# Altium project Mp100.PrjPCB
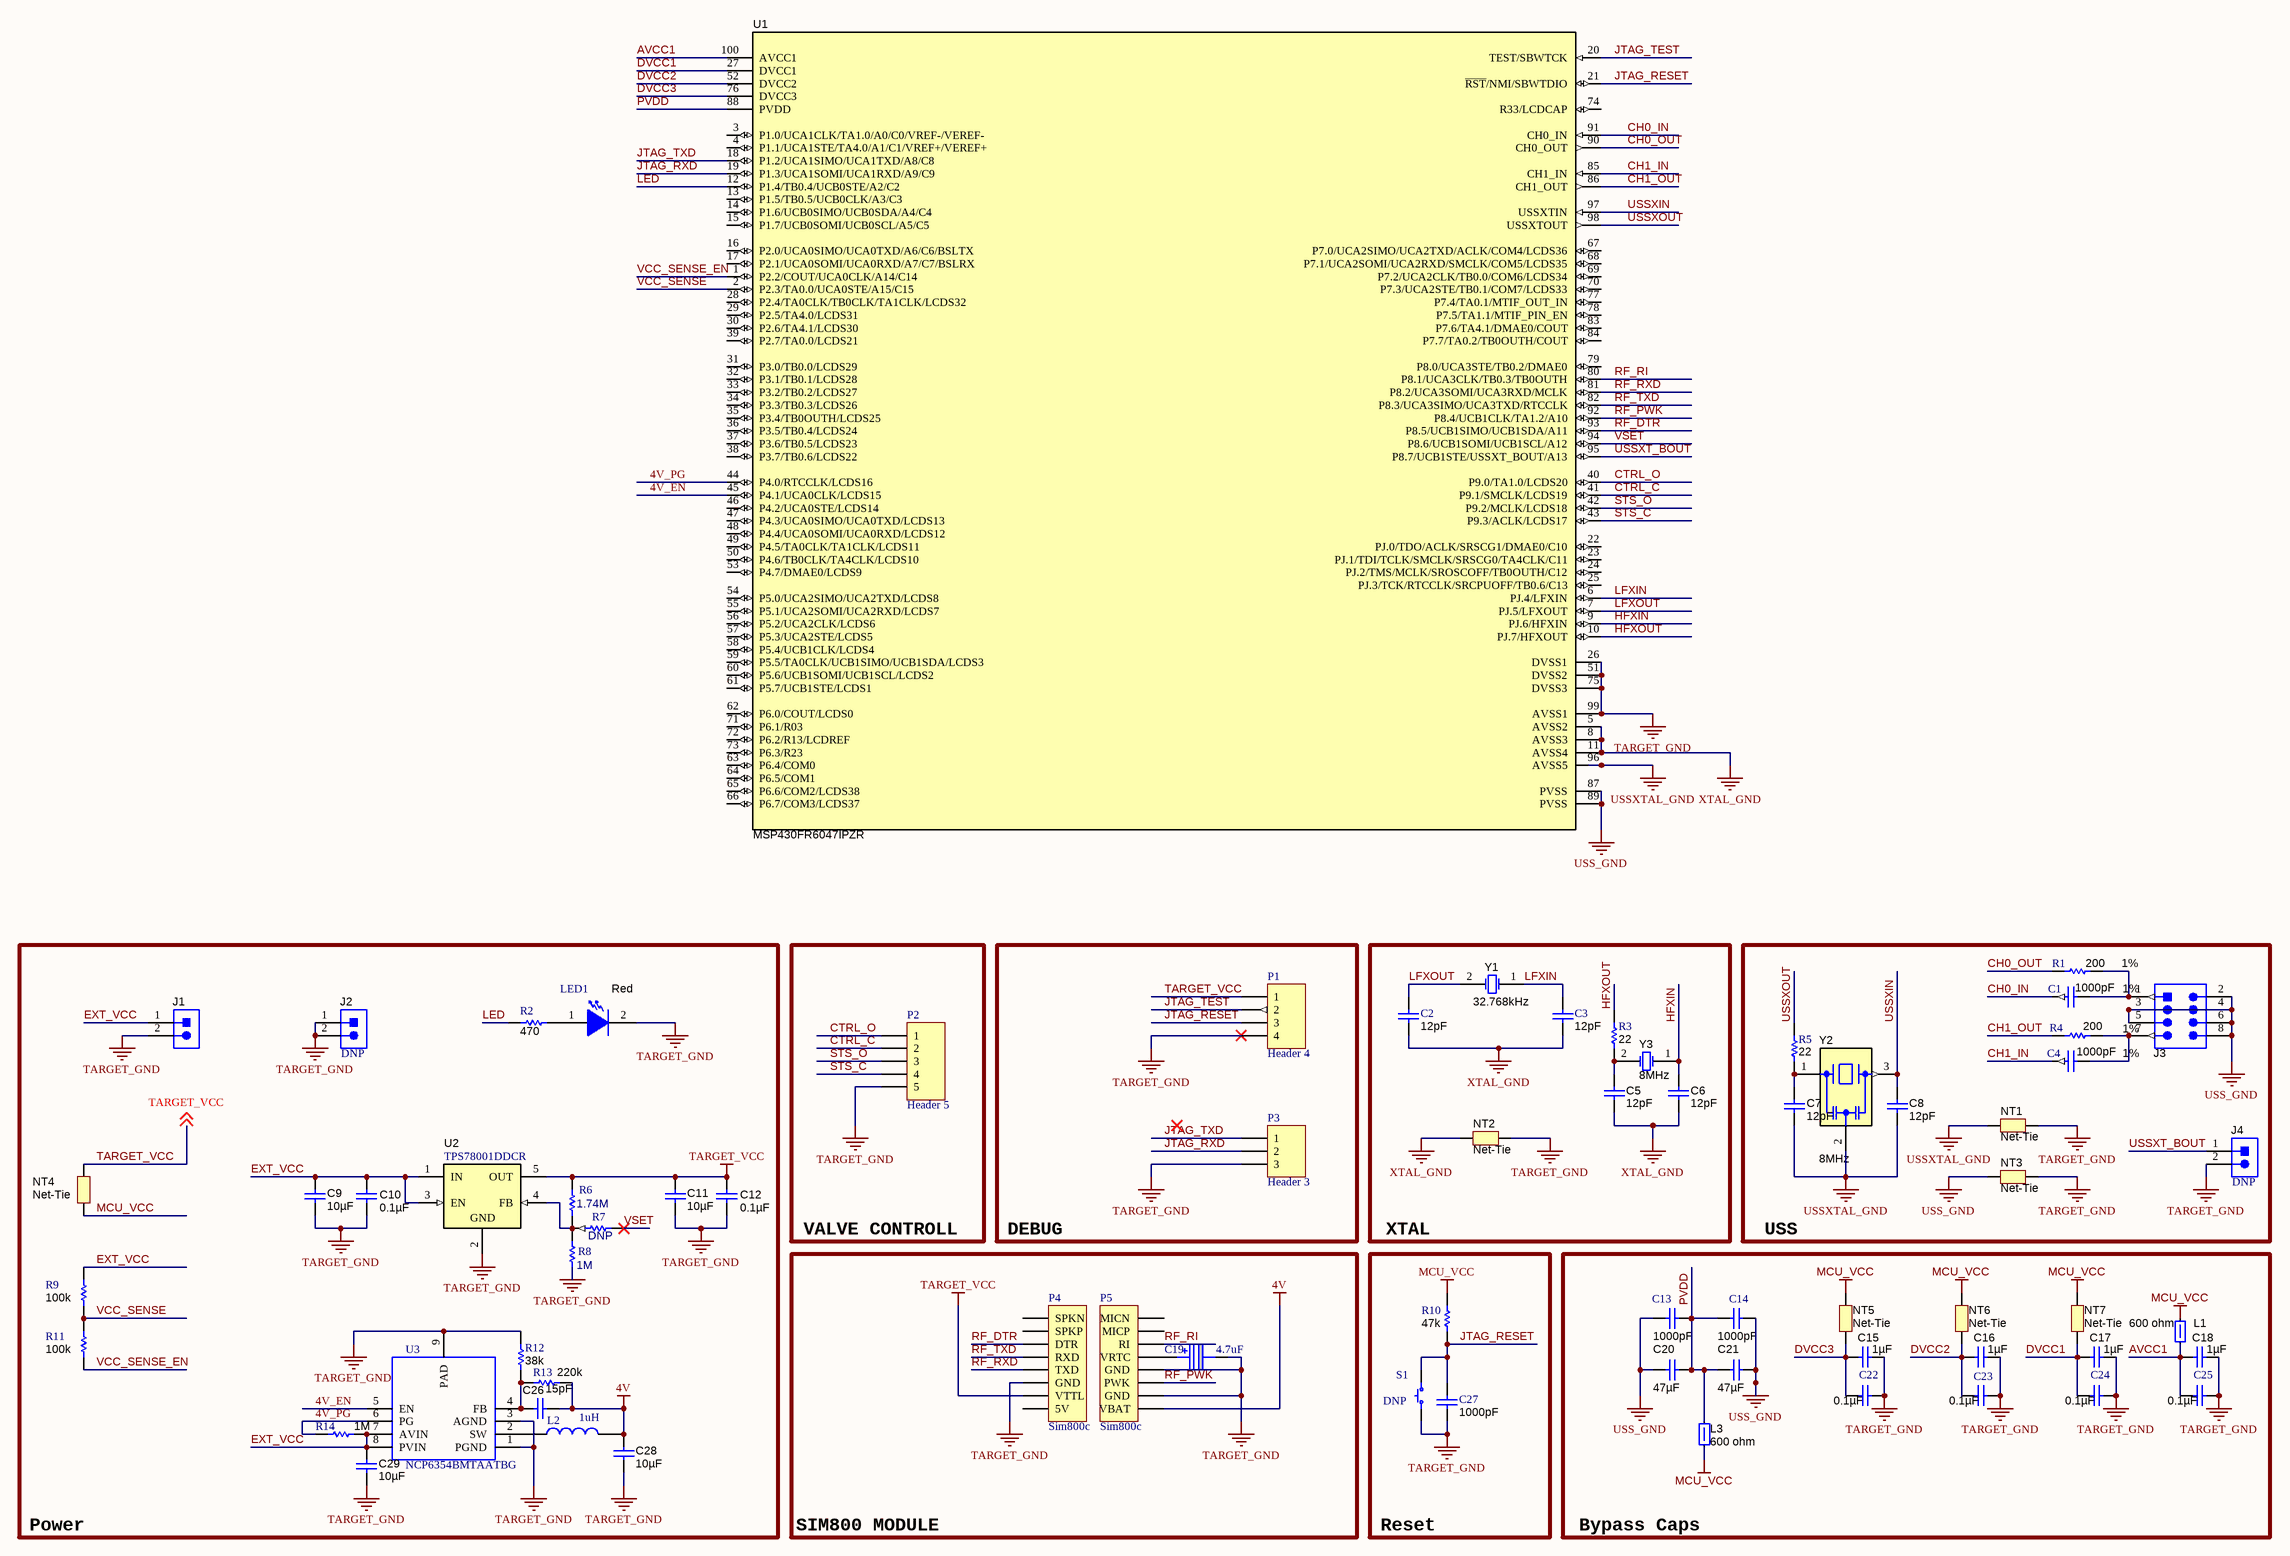
[diagram p0: Mp100.SchDoc]
1 sheet, 70 parts. Net scope: global (net labels, ports and power ports of the same name join across sheets).
Board file: Mp100.PcbDoc

## Sheet Mp100.SchDoc: MP100
size C; CompanyName: AquaSAFE; Organization: AquaSAFE; Address1: Kaf-tet BeNovember 12a; Address2: Zechron yakkov; Address3: 3090000; Address4: Israel; DocumentNumber: 1; Revision: 0.3

### Parts
C1  ValueDisplayed: 1000pF  Tolerance_%: 1%  [CAPC1608X90N]  (hidden comment: GRM1885C1H102FA01J)
C2  ValueDisplayed: 12pF  [CAPC1005X55N]  (hidden comment: GRM1555C1H120JA01D)
C3  ValueDisplayed: 12pF  [CAPC1005X55N]  (hidden comment: GRM1555C1H120JA01D)
C4  ValueDisplayed: 1000pF  Tolerance_%: 1%  [CAPC1608X90N]  (hidden comment: GRM1885C1H102FA01J)
C5  ValueDisplayed: 12pF  [CAPC1005X55N]  (hidden comment: GRM1555C1H120JA01D)
C6  ValueDisplayed: 12pF  [CAPC1005X55N]  (hidden comment: GRM1555C1H120JA01D)
C7  ValueDisplayed: 12pF  [CAPC1005X55N]  (hidden comment: GRM1555C1H120JA01D)
C8  ValueDisplayed: 12pF  [CAPC1005X55N]  (hidden comment: GRM1555C1H120JA01D)
C9  ValueDisplayed: 10µF  [CAPC1608X90N]  (hidden comment: GRM188R61A106ME69D)
C10  ValueDisplayed: 0.1µF  [CAPC1005X55N]  (hidden comment: GRM155R71C104KA88D)
C11  ValueDisplayed: 10µF  [CAPC1608X90N]  (hidden comment: GRM188R61A106ME69D)
C12  ValueDisplayed: 0.1µF  [CAPC1005X55N]  (hidden comment: GRM155R71C104KA88D)
C13  ValueDisplayed: 1000pF  [CAPC1005X55N]  (hidden comment: GRM1555C1H102JA01D)
C14  ValueDisplayed: 1000pF  [CAPC1005X55N]  (hidden comment: GRM1555C1H102JA01D)
C15  ValueDisplayed: 1µF  [CAPC1608X90N]  (hidden comment: GRM188R71A105KA61D)
C16  ValueDisplayed: 1µF  [CAPC1608X90N]  (hidden comment: GRM188R71A105KA61D)
C17  ValueDisplayed: 1µF  [CAPC1608X90N]  (hidden comment: GRM188R71A105KA61D)
C18  ValueDisplayed: 1µF  [CAPC1608X90N]  (hidden comment: GRM188R71A105KA61D)
C19  DisplayValue: 4.7uF  [CAPAE430X550N]  (hidden comment: 865090340001)
C20  ValueDisplayed: 47µF  [CAPC2012X145N]  (hidden comment: GRM21BR60J476ME15L)
C21  ValueDisplayed: 47µF  [CAPC2012X145N]  (hidden comment: GRM21BR60J476ME15L)
C22  ValueDisplayed: 0.1µF  [CAPC1005X55N]  (hidden comment: GRM155R71C104KA88D)
C23  ValueDisplayed: 0.1µF  [CAPC1005X55N]  (hidden comment: GRM155R71C104KA88D)
C24  ValueDisplayed: 0.1µF  [CAPC1005X55N]  (hidden comment: GRM155R71C104KA88D)
C25  ValueDisplayed: 0.1µF  [CAPC1005X55N]  (hidden comment: GRM155R71C104KA88D)
C26  ValueDisplayed: 15pF  [CAPC1005X55N]  (hidden comment: GRM1555C1H120JA01D)
C27  ValueDisplayed: 1000pF  [CAPC1005X55N]  (hidden comment: GRM1555C1H102JA01D)
C28  ValueDisplayed: 10µF  [CAPC1608X90N]  (hidden comment: GRM188R61A106ME69D)
C29  ValueDisplayed: 10µF  [CAPC1608X90N]  (hidden comment: GRM188R61A106ME69D)
J1  TSW-102-07-G-S  [HDR1X2]  (value not drawn)  (no BOM)
J2  TSW-102-07-G-S  [HDR1X2]  (value not drawn)  (no BOM)
J3  TSW-104-07-G-D  [HDR2X4]  (value not drawn)  (no BOM)
J4  HMTSW-102-07-G-S-240  [HDR1X2]  (value not drawn)  (no BOM)
L1  value 600 ohm  [6-0805_L]  (hidden comment: MPZ2012S601A)
L2  value 1uH  [INDM4040X180N]  (hidden comment: LQH44PN1R0NP0L)
L3  value 600 ohm  [6-0805_L]  (hidden comment: MPZ2012S601A)
LED1  value Red  [LEDC1608X90N]  (hidden comment: LTST-C190CKT)
NT1  Net-Tie  [2way_MP]  (net tie, no BOM)
NT2  Net-Tie  [2way_MP]  (net tie, no BOM)
NT3  Net-Tie  [2way_MP]  (net tie, no BOM)
NT4  Net-Tie  [2way_MP]  (net tie, no BOM)
NT5  Net-Tie  [2way_MP]  (net tie, no BOM)
NT6  Net-Tie  [2way_MP]  (net tie, no BOM)
NT7  Net-Tie  [2way_MP]  (net tie, no BOM)
P1  Header 4  [HDR1X4]  (no BOM)
P2  Header 5  [HDR1X5]  (no BOM)
P3  Header 3  [HDR1X3]  (no BOM)
P4  Sim800c  [HDR1X8]  (no BOM)
P5  Sim800c  [HDR1X8]  (no BOM)
R1  ValueDisplayed: 200  Value1: 1%  [RESC1005X40N]  (hidden comment: CRCW0402200RFKED)
R2  ValueDisplayed: 470  [RESC1005X40N]  (hidden comment: CRCW0402470RJNED)
R3  ValueDisplayed: 22  [RESC1005X40N]  (hidden comment: CRCW040222R0JNED)
R4  ValueDisplayed: 200  Value1: 1%  [RESC1005X40N]  (hidden comment: CRCW0402200RFKED)
R5  ValueDisplayed: 22  [RESC1005X40N]  (hidden comment: CRCW040222R0JNED)
R6  value 1.74M  [RESC1005X40N]  (hidden comment: CRCW04021M74FKED)
R7  DNP  [RESC1005X40N]  (no BOM)
R8  value 1M  [RESC1005X40N]  (hidden comment: CRCW04021M00JNED)
R9  ValueDisplayed: 100k  [RESC1005X40N]  (hidden comment: CRCW0402100KJNED)
R10  ValueDisplayed: 47k  [RESC1005X40N]  (hidden comment: CRCW040247K0JNED)
R11  ValueDisplayed: 100k  [RESC1005X40N]  (hidden comment: CRCW0402100KJNED)
R12  ValueDisplayed: 38k  [RESC1005X40N]  (hidden comment: CRCW0402470RJNED)
R13  ValueDisplayed: 220k  [RESC1005X40N]  (hidden comment: CRCW0402470RJNED)
R14  ValueDisplayed: 1M  [RESC1005X40N]  (hidden comment: CRCW0402100KJNED)
S1  placment: DNP  [HDR1X2]  (hidden comment: SPST-NO)  (no BOM)
U1  MSP430FR6047IPZR  [QFP50P1600X1600X160-100N]
U2  TPS78001DDCR  [SOT95P280X145-5N]
U3  NCP6354BMTAATBG  [SON50P200X200X80-9N-D]
Y1  Frequency: 32.768kHz  [ABS-07]  (hidden comment: ABS07-32.768KHZ-9-T)
Y2  Frequency: 8MHz  [Abracon_AWSCR-8.00CV-T_0]  (hidden comment: AWSCR-8.00CV-T)
Y3  Frequency: 8MHz  [ABM38000MHzD2YT]  (hidden comment: ABM3-8.000MHZ-D2Y-T)

### Blocks framed on the sheet
Power: C9-C12 C26 C28 C29 J1 J2 L2 LED1 NT4 R2 R6-R9 R11-R14 U2 U3
VALVE CONTROLL: P2
DEBUG: P1 P3
XTAL: C2 C3 C5 C6 NT2 R3 Y1 Y3
USS: C1 C4 C7 C8 J3 J4 NT1 NT3 R1 R4 R5 Y2
SIM800 MODULE: C19 P4 P5
Reset: C27 R10 S1
Bypass Caps: C13-C18 C20-C25 L1 L3 NT5-NT7

### Nets
4V: C26.2 C28.1 L2.2 P5.1(VBAT) R13.2
MCU_VCC: L1.2 L3.2 NT4.1 NT5.2 NT6.2 NT7.2 R10.2
TARGET_GND: C9.2 C10.2 C11.2 C12.2 C15.2 C16.1 C17.2 C18.2 C19.2(-) C22.2 C23.2 C24.1 C25.2 C27.2 C28.2 C29.2 J1.2 J2.1 J2.2 J4.2 LED1.2(K) NT1.2 NT2.2 NT3.2 P1.4 P2.5 P3.3 P4.6(GND) P5.2(GND) P5.4(GND) R8.1 R12.1 S1.1 U1.26(DVSS1) U1.51(DVSS2) U1.75(DVSS3) U1.99(AVSS1) U2.2(GND) U3.1(PGND) U3.3(AGND) U3.9(PAD)
TARGET_VCC: C11.1 C12.1 NT4.2 P1.1 P4.7(VTTL) R6.2 U2.5(OUT) ; off-sheet TARGET_VCC
USS_GND: C13.2 C14.1 C20.1 C21.2 J3.2 J3.3 J3.4 J3.5 J3.6 J3.8 NT3.1 U1.87(PVSS) U1.89(PVSS)
USSXTAL_GND: C7.2 C8.2 NT1.1 U1.96(AVSS5) Y2.2(GND)
XTAL_GND: C2.1 C3.2 C5.2 C6.2 NT2.1 U1.5(AVSS2) U1.8(AVSS3) U1.11(AVSS4)
4V_EN: U1.45(P4.1/UCA0CLK/LCDS15) U3.5(EN)
4V_PG: R14.2 U1.44(P4.0/RTCCLK/LCDS16) U3.6(PG)
AVCC1: C18.1 C25.1 L1.1 U1.100(AVCC1)
CH0_IN: C1.1 U1.91(CH0_IN)
CH0_OUT: R1.2 U1.90(CH0_OUT)
CH1_IN: C4.1 U1.85(CH1_IN)
CH1_OUT: R4.2 U1.86(CH1_OUT)
CTRL_C: P2.2 U1.41(P9.1/SMCLK/LCDS19)
CTRL_O: P2.1 U1.40(P9.0/TA1.0/LCDS20)
DVCC1: C17.1 C24.2 NT7.1 U1.27(DVCC1)
DVCC2: C16.2 C23.1 NT6.1 U1.52(DVCC2)
DVCC3: C15.1 C22.1 NT5.1 U1.76(DVCC3)
EXT_VCC: C9.1 C10.1 C29.1 J1.1 R9.2 R14.1 U2.1(IN) U2.3(EN) U3.7(AVIN) U3.8(PVIN)
HFXIN: C6.1 U1.9(PJ.6/HFXIN) Y3.1(OSC1)
HFXOUT: R3.2 U1.10(PJ.7/HFXOUT)
JTAG_RESET: C27.1 P1.3 R10.1 S1.3 U1.21(~{RST}/NMI/SBWTDIO)
JTAG_RXD: P3.2 U1.19(P1.3/UCA1SOMI/UCA1RXD/A9/C9)
JTAG_TEST: P1.2 U1.20(TEST/SBWTCK)
JTAG_TXD: P3.1 U1.18(P1.2/UCA1SIMO/UCA1TXD/A8/C8)
LED: R2.1 U1.12(P1.4/TB0.4/UCB0STE/A2/C2)
LFXIN: C3.1 U1.6(PJ.4/LFXIN) Y1.1(OSC1)
LFXOUT: C2.2 U1.7(PJ.5/LFXOUT) Y1.2(OSC2)
PVDD: C13.1 C14.2 C20.2 C21.1 L3.1 U1.88(PVDD)
RF_DTR: P4.3(DTR) U1.93(P8.5/UCB1SIMO/UCB1SDA/A11)
RF_PWK: P5.3(PWK) U1.92(P8.4/UCB1CLK/TA1.2/A10)
RF_RI: P5.6(RI) U1.80(P8.1/UCA3CLK/TB0.3/TB0OUTH)
RF_RXD: P4.5(TXD) U1.81(P8.2/UCA3SOMI/UCA3RXD/MCLK)
RF_TXD: P4.4(RXD) U1.82(P8.3/UCA3SIMO/UCA3TXD/RTCCLK)
STS_C: P2.4 U1.43(P9.3/ACLK/LCDS17)
STS_O: P2.3 U1.42(P9.2/MCLK/LCDS18)
USSXIN: C8.1 U1.97(USSXTIN) Y2.3(Out)
USSXOUT: R5.2 U1.98(USSXTOUT)
USSXT_BOUT: J4.1 U1.95(P8.7/UCB1STE/USSXT_BOUT/A13)
VCC_SENSE: R9.1 R11.2 U1.2(P2.3/TA0.0/UCA0STE/A15/C15)
VCC_SENSE_EN: R11.1 U1.1(P2.2/COUT/UCA0CLK/A14/C14)
VSET: R7.1 U1.94(P8.6/UCB1SOMI/UCB1SCL/A12)
NetC1_2: C1.2 J3.1 R1.1
NetC4_2: C4.2 J3.7 R4.1
NetC5_1: C5.1 R3.1 Y3.2(OSC2)
NetC7_1: C7.1 R5.1 Y2.1(In)
NetC19_1: C19.1(+) P5.5(VRTC)
NetC26_1: C26.1 R12.2 R13.1 U3.4(FB)
NetL2_1: L2.1 U3.2(SW)
NetLED1_1: LED1.1(A) R2.2
NetR6_1: R6.1 R7.2 R8.2 U2.4(FB)

Not connected (* = marked no-connect by the designer): P4 1(SPKN) 2(SPKP) 8(5V); P5 7(MICP) 8(MICN); U1 3(P1.0/UCA1CLK/TA1.0/A0/C0/VREF-/VEREF-) 4(P1.1/UCA1STE/TA4.0/A1/C1/VREF+/VEREF+) 13(P1.5/TB0.5/UCB0CLK/A3/C3) 14(P1.6/UCB0SIMO/UCB0SDA/A4/C4) 15(P1.7/UCB0SOMI/UCB0SCL/A5/C5) 16(P2.0/UCA0SIMO/UCA0TXD/A6/C6/BSLTX) 17(P2.1/UCA0SOMI/UCA0RXD/A7/C7/BSLRX) 22(PJ.0/TDO/ACLK/SRSCG1/DMAE0/C10) 23(PJ.1/TDI/TCLK/SMCLK/SRSCG0/TA4CLK/C11) 24(PJ.2/TMS/MCLK/SROSCOFF/TB0OUTH/C12) 25(PJ.3/TCK/RTCCLK/SRCPUOFF/TB0.6/C13) 28(P2.4/TA0CLK/TB0CLK/TA1CLK/LCDS32) 29(P2.5/TA4.0/LCDS31) 30(P2.6/TA4.1/LCDS30) 31(P3.0/TB0.0/LCDS29) 32(P3.1/TB0.1/LCDS28) 33(P3.2/TB0.2/LCDS27) 34(P3.3/TB0.3/LCDS26) 35(P3.4/TB0OUTH/LCDS25) 36(P3.5/TB0.4/LCDS24) 37(P3.6/TB0.5/LCDS23) 38(P3.7/TB0.6/LCDS22) 39(P2.7/TA0.0/LCDS21) 46(P4.2/UCA0STE/LCDS14) 47(P4.3/UCA0SIMO/UCA0TXD/LCDS13) 48(P4.4/UCA0SOMI/UCA0RXD/LCDS12) 49(P4.5/TA0CLK/TA1CLK/LCDS11) 50(P4.6/TB0CLK/TA4CLK/LCDS10) 53(P4.7/DMAE0/LCDS9) 54(P5.0/UCA2SIMO/UCA2TXD/LCDS8) 55(P5.1/UCA2SOMI/UCA2RXD/LCDS7) 56(P5.2/UCA2CLK/LCDS6) 57(P5.3/UCA2STE/LCDS5) 58(P5.4/UCB1CLK/LCDS4) 59(P5.5/TA0CLK/UCB1SIMO/UCB1SDA/LCDS3) 60(P5.6/UCB1SOMI/UCB1SCL/LCDS2) 61(P5.7/UCB1STE/LCDS1) 62(P6.0/COUT/LCDS0) 63(P6.4/COM0) 64(P6.5/COM1) 65(P6.6/COM2/LCDS38) 66(P6.7/COM3/LCDS37) 67(P7.0/UCA2SIMO/UCA2TXD/ACLK/COM4/LCDS36) 68(P7.1/UCA2SOMI/UCA2RXD/SMCLK/COM5/LCDS35) 69(P7.2/UCA2CLK/TB0.0/COM6/LCDS34) 70(P7.3/UCA2STE/TB0.1/COM7/LCDS33) 71(P6.1/R03) 72(P6.2/R13/LCDREF) 73(P6.3/R23) 74(R33/LCDCAP) 77(P7.4/TA0.1/MTIF_OUT_IN) 78(P7.5/TA1.1/MTIF_PIN_EN) 79(P8.0/UCA3STE/TB0.2/DMAE0) 83(P7.6/TA4.1/DMAE0/COUT) 84(P7.7/TA0.2/TB0OUTH/COUT)

### Notes on the sheet
- Title
- Size:
- Date:
- File:
- C
- Number:
- Time:
- Revision:
- Sheet
- of

### Library data of the parts
C1 C4 = GRM1885C1H102FA01J: CAP, CERM, 1000 pF, 50 V, +/- 1%, C0G/NP0, 0603; Manufacturer: MuRata; Value: 1000pF; Polarized: N; CompType: Capacitor; U/M: EA; Cap_F: 0.000000001; Value1: Unknown; VDC_V: 50; Value2: 50V; TaMin_C: -55; TaMax_C: 125; Cap_Case: 0603; AEC Category: Q200; Published: 2008-06-19; LatestRevisionDate: 2016-04-09; PackageReference: 0603; Publisher: Texas Instruments; SymbolVersion: 2008-07-09; PartNumber: GRM1885C1H102FA01J; RoHS: Y; MountType: SMT; Technology: Ceramic; TempCo: C0G/NP0; ComponentLink1Description: Datasheet link; ComponentLink1URL: http://search.murata.co.jp/Ceramy/image/img/A01X/G101/ENG/GRM1885C1H102FA01-01.pdf; Supplier 1: Digi-Key; Supplier Part Number 1: 490-6377-1-ND; AEC Qualified: ?
C2 C3 = GRM1555C1H120JA01D: CAP, CERM, 12 pF, 50 V, +/- 5%, C0G/NP0, 0402; Manufacturer: MuRata; Value: 12pF; Polarized: N; CompType: Capacitor; U/M: EA; Cap_F: 0.000000000012; Tolerance_%: 5; Value1: Unknown; VDC_V: 50; Value2: 50V; TaMin_C: -55; TaMax_C: 125; Cap_Case: 0402; AEC Category: Q200; Published: 2008-06-19; LatestRevisionDate: 2016-04-09; PackageReference: 0402; Publisher: Texas Instruments; SymbolVersion: 2008-07-09; PartNumber: GRM1555C1H120JA01D; RoHS: Y; MountType: SMT; Technology: Ceramic; TempCo: C0G/NP0; ComponentLink1Description: Datasheet link; ComponentLink1URL: http://search.murata.co.jp/Ceramy/PnsearchViewAction.do?HnOFG=ON&HnNFG=ON&SEL_CNT=50&sLang=en&sKey=GRM1555C1H120JA01D&x=9&y=9&search=startwith; Supplier 1: Mouser; Supplier Part Number 1: 81-GRM1555C1H120JA1D; Supplier 2: Farnell; Supplier Part Number 2: 1828875; Supplier 3: Newark; Supplier Part Number 3: 14T3292; AEC Qualified: ?
C5-C8 C26 = GRM1555C1H120JA01D: CAP, CERM, 12 pF, 50 V, +/- 5%, C0G/NP0, 0402; Manufacturer: MuRata; Polarized: N; CompType: Capacitor; Value: 12pF; U/M: EA; Cap_F: 0.000000000012; Tolerance_%: 5; Value1: Unknown; VDC_V: 50; Value2: 50V; TaMin_C: -55; TaMax_C: 125; Cap_Case: 0402; SizeArea_mm2: 0.5; SizeAreaWB_mm2: 3; SizeX_mm: 1; SizeZ_mm: 0.6; AEC Category: Q200; SymbolVersion: 2008-07-09; PartNumber: GRM1555C1H120JA01D; PackageReference: 0402; RoHS: Y; MountType: SMT; Technology: Ceramic; TempCo: C0G/NP0; SizeY_mm: 0.5; Published: 2008-06-19; Publisher: Texas Instruments; ComponentLink1Description: Datasheet link; ComponentLink1URL: http://search.murata.co.jp/Ceramy/PnsearchViewAction.do?HnOFG=ON&HnNFG=ON&SEL_CNT=50&sLang=en&sKey=GRM1555C1H120JA01D&x=9&y=9&search=startwith; Supplier 1: Mouser; Supplier Part Number 1: 81-GRM1555C1H120JA1D; Supplier 2: Farnell; Supplier Part Number 2: 1828875; Supplier 3: Newark; Supplier Part Number 3: 14T3292; AEC Qualified: ?
  C5 C6 C26: LatestRevisionDate: 2016-11-28
  C7 C8: LatestRevisionDate: 2017-01-30
C9 C11 C28 C29 = GRM188R61A106ME69D: CAP, CERM, 10 µF, 10 V, +/- 20%, X5R, 0603; Manufacturer: MuRata; Polarized: N; CompType: Capacitor; Value: 10uF; U/M: EA; Cap_F: 0.00001; Tolerance_%: 20; Value1: Unknown; VDC_V: 10; Value2: 10V; TaMin_C: -55; TaMax_C: 85; Cap_Case: 0603; AEC Category: Q200; SizeArea_mm2: 1.28; SizeAreaWB_mm2: 4.68; SizeX_mm: 1.6; SizeY_mm: 0.8; SizeZ_mm: 1; SymbolVersion: 2008-07-09; PartNumber: GRM188R61A106ME69D; PackageReference: 0603; RoHS: Y; MountType: SMT; Technology: Ceramic; Publisher: Texas Instruments; LatestRevisionDate: 2016-05-21; ComponentLink1Description: Datasheet link; ComponentLink1URL: http://psearch.murata.com/capacitor/product/GRM188R61A106ME69%23.pdf; TempCo: X5R; Published: 2008-06-19; AEC Qualified: ?; Supplier 4: Quest; Supplier Part Number 4: GRM188R61A106ME69D
C10 C12 = GRM155R71C104KA88D: CAP, CERM, 0.1 µF, 16 V, +/- 10%, X7R, 0402; Manufacturer: MuRata; Polarized: N; CompType: Capacitor; Value: 0.1uF; U/M: EA; Cap_F: 0.0000001; Tolerance_%: 10; Value1: Unknown; VDC_V: 16; Value2: 16V; TaMin_C: -55; TaMax_C: 125; Cap_Case: 0402; AEC Category: Q200; SymbolVersion: 2008-07-09; PartNumber: GRM155R71C104KA88D; PackageReference: 0402; RoHS: Y; MountType: SMT; Technology: Ceramic; TempCo: X7R; Published: 2008-06-19; Publisher: Texas Instruments; LatestRevisionDate: 2016-03-01; ComponentLink1Description: Datasheet link; ComponentLink1URL: http://search.murata.co.jp/Ceramy/PnsearchViewAction.do?HnOFG=ON&HnNFG=ON&SEL_CNT=50&sLang=en&sKey=GRM155R71C104KA88D&x=9&y=9&search=startwith; Supplier 1: Digi-Key; Supplier Part Number 1: 490-3261-1-ND; Supplier 2: Mouser; Supplier Part Number 2: 81-GRM155R71C104KA88; Supplier 3: Farnell; Supplier Part Number 3: 8819742; AEC Qualified: ?
C13 C14 C27 = GRM1555C1H102JA01D: CAP, CERM, 1000 pF, 50 V, +/- 5%, C0G/NP0, 0402; Manufacturer: MuRata; Value: 1000pF; Polarized: N; CompType: Capacitor; U/M: EA; Cap_F: 0.000000001; Tolerance_%: 5; Value1: Unknown; VDC_V: 50; Value2: 50V; TaMin_C: -55; TaMax_C: 125; Cap_Case: 0402; AEC Category: Q200; Published: 2008-06-19; LatestRevisionDate: 2016-04-09; PackageReference: 0402; Publisher: Texas Instruments; SymbolVersion: 2008-07-09; PartNumber: GRM1555C1H102JA01D; RoHS: Y; MountType: SMT; Technology: Ceramic; TempCo: C0G/NP0; ComponentLink1Description: Datasheet link; ComponentLink1URL: http://search.murata.co.jp/Ceramy/PnsearchViewAction.do?HnOFG=ON&HnNFG=ON&SEL_CNT=50&sLang=en&sKey=GRM1555C1H102JA01D&x=9&y=9&search=startwith; Supplier 1: Digi-Key; Supplier Part Number 1: 490-3244-1-ND; Supplier 2: Mouser; Supplier Part Number 2: 81-GRM1555C1H102JA1D; Supplier 3: Farnell; Supplier Part Number 3: 8819556; AEC Qualified: ?
  C27: Supplier 4: Freelance Electronics; Supplier Part Number 4: GRM1555C1H102JA01D
C15-C17 = GRM188R71A105KA61D: CAP, CERM, 1 µF, 10 V, +/- 10%, X7R, 0603; Manufacturer: MuRata; Polarized: N; CompType: Capacitor; Value: 1uF; U/M: EA; Cap_F: 0.000001; Tolerance_%: 10; ESR_ohm: 0.011; Value1: 0.011 ohm; Value2: 10V; TaMin_C: -55; TaMax_C: 125; Cap_Case: 0603; SizeArea_mm2: 1.28; SizeAreaWB_mm2: 4.68; SizeX_mm: 1.6; SizeY_mm: 0.8; SizeZ_mm: 1; AEC Category: Q200; SymbolVersion: 2008-07-09; PartNumber: GRM188R71A105KA61D; PackageReference: 0603; RoHS: Y; VDC_V: 10; MountType: SMT; Technology: Ceramic; TempCo: X7R; Published: 2008-06-19; Publisher: Texas Instruments; LatestRevisionDate: 2016-05-21; ComponentLink1Description: Datasheet link; ComponentLink1URL: http://search.murata.co.jp/Ceramy/PnsearchViewAction.do?HnOFG=ON&HnNFG=ON&SEL_CNT=50&sLang=en&sKey=GRM188R71A105KA61D&x=9&y=9&search=startwith; Supplier 1: Digi-Key; Supplier Part Number 1: 490-3899-1-ND; Supplier 2: Mouser; Supplier Part Number 2: 81-GRM188R71A105KA1D; Supplier 3: Farnell; Supplier Part Number 3: 1845766; AEC Qualified: ?
C18 = GRM188R71A105KA61D: CAP, CERM, 1 µF, 10 V, +/- 10%, X7R, 0603; Manufacturer: MuRata; Polarized: N; CompType: Capacitor; Value: 1uF; U/M: EA; Cap_F: 0.000001; Tolerance_%: 10; ESR_ohm: 0.011; Value1: 0.011 ohm; Value2: 10V; TaMin_C: -55; TaMax_C: 125; Cap_Case: 0603; AEC Category: Q200; SizeArea_mm2: 1.28; SizeAreaWB_mm2: 4.68; SizeX_mm: 1.6; SizeY_mm: 0.8; SizeZ_mm: 1; SymbolVersion: 2008-07-09; PartNumber: GRM188R71A105KA61D; PackageReference: 0603; RoHS: Y; VDC_V: 10; MountType: SMT; Technology: Ceramic; TempCo: X7R; Published: 2008-06-19; Publisher: Texas Instruments; LatestRevisionDate: 2016-05-21; ComponentLink1Description: Datasheet link; ComponentLink1URL: http://search.murata.co.jp/Ceramy/PnsearchViewAction.do?HnOFG=ON&HnNFG=ON&SEL_CNT=50&sLang=en&sKey=GRM188R71A105KA61D&x=9&y=9&search=startwith; Supplier 1: Digi-Key; Supplier Part Number 1: 490-3899-1-ND; Supplier 2: Mouser; Supplier Part Number 2: 81-GRM188R71A105KA1D; Supplier 3: Farnell; Supplier Part Number 3: 1845766; AEC Qualified: ?
C19 = 865090340001: Wurth Elektronik 4.7F 16 V dc Aluminium Electrolytic Capacitor, WCAP-ASLU Series 1000h 5.5 (Dia.) x 3.85mm; Geometry.Height: 5.5mm; Manufacturer_Name: Wurth Elektronik; PartNumber: 865090340001; RS Part Number: *; RS Price/Stock: *; Arrow Part Number: 865090340001; Arrow Price/Stock: *; Datasheet Link: http://uk.rs-online.com/web/p/products/8387942
C20 C21 = GRM21BR60J476ME15L: CAP, CERM, 47 µF, 6.3 V, +/- 20%, X5R, 0805; Manufacturer: MuRata; Polarized: N; CompType: Capacitor; Value: 47uF; U/M: EA; Cap_F: 0.000047; Tolerance_%: 20; Value1: Unknown; VDC_V: 6.3; Value2: 6.3V; TaMin_C: -55; TaMax_C: 85; Cap_Case: 0805; AEC Category: Q200; SizeArea_mm2: 2.5; SizeAreaWB_mm2: 6.75; SizeX_mm: 2; SizeY_mm: 1.25; SizeZ_mm: 1.45; SymbolVersion: 2008-07-09; PartNumber: GRM21BR60J476ME15L; PackageReference: 0805; RoHS: Y; MountType: SMT; Technology: Ceramic; TempCo: X5R; Published: 2008-06-19; Publisher: Texas Instruments; LatestRevisionDate: 2016-05-21; ComponentLink1Description: Datasheet link; ComponentLink1URL: http://psearch.en.murata.com/capacitor/product/GRM21BR60J476ME15%23.pdf; Supplier 1: Digi-Key; Supplier Part Number 1: 490-9960-1-ND; Supplier 2: Mouser; Supplier Part Number 2: 81-GRM21BR60J476ME5L; Supplier 3: Farnell; Supplier Part Number 3: 2362109; AEC Qualified: N; AEC Grade: N/A
C22-C25 = GRM155R71C104KA88D: CAP, CERM, 0.1 µF, 16 V, +/- 10%, X7R, 0402; Manufacturer: MuRata; Value: 0.1uF; Polarized: N; CompType: Capacitor; U/M: EA; Cap_F: 0.0000001; Tolerance_%: 10; Value1: Unknown; VDC_V: 16; Value2: 16V; TaMin_C: -55; TaMax_C: 125; Cap_Case: 0402; AEC Category: Q200; Published: 2008-06-19; LatestRevisionDate: 2016-03-01; PackageReference: 0402; Publisher: Texas Instruments; SymbolVersion: 2008-07-09; PartNumber: GRM155R71C104KA88D; RoHS: Y; MountType: SMT; Technology: Ceramic; TempCo: X7R; ComponentLink1Description: Datasheet link; ComponentLink1URL: http://search.murata.co.jp/Ceramy/PnsearchViewAction.do?HnOFG=ON&HnNFG=ON&SEL_CNT=50&sLang=en&sKey=GRM155R71C104KA88D&x=9&y=9&search=startwith; Supplier 1: Digi-Key; Supplier Part Number 1: 490-3261-1-ND; Supplier 2: Mouser; Supplier Part Number 2: 81-GRM155R71C104KA88; Supplier 3: Farnell; Supplier Part Number 3: 8819742; AEC Qualified: ?
J1 J2 = TSW-102-07-G-S: Header, 100mil, 2x1, Gold, TH; Manufacturer: Samtec; SymbolCreator: a0412235; Pitch_mm: 2.54; Gender: Male; Shrouded: N; Row_Count: 1; Current_A: 6.3; Voltage_V: 550; Cert_CSA: Y; SymbolVersion: 2013-10-31; PartNumber: TSW-102-07-G-S; PackageReference: 2x1 Header; ClassName: Header; CompType: Header; RoHS: Y; MountType: TH; ComponentLink1Description: Datasheet URL; ComponentLink1URL: http://samtec.com/ftppub/pdf/TSW_TH.PDF; Orientation: Vertical; PinCount: 2; ContactFinish: Gold; Color: Black; Cert_UL: Y; Cert_CULUS: N; Cert_VDE: N; Publisher: Texas Instruments; LatestRevisionDate: 2016-04-11; Supplier 1: Digi-Key; Supplier Part Number 1: SAM1029-02-ND
  J2: DNP: DNP
J3 = TSW-104-07-G-D: Header, 100mil, 4x2, Gold, TH; Manufacturer: Samtec; SymbolCreator: a0411947; Pitch_mm: 2.54; Gender: Male; Shrouded: N; Row_Count: 2; Current_A: 6.3; Voltage_V: 550; Cert_CSA: Y; SymbolVersion: 2013-12-22; PartNumber: TSW-104-07-G-D; PackageReference: 4x2 Header; ClassName: Header; CompType: Header; RoHS: Y; MountType: TH; ComponentLink1Description: Datasheet URL; ComponentLink1URL: http://samtec.com/ftppub/pdf/TSW_TH.PDF; Orientation: Vertical; PinCount: 8; RowSpacing_mm: 2.54; ContactFinish: Gold; Color: Black; Cert_UL: Y; Cert_CULUS: N; Cert_VDE: N; Publisher: Texas Instruments; LatestRevisionDate: 2016-12-09; Supplier 1: Digi-Key; Supplier Part Number 1: SAM1028-04-ND; Supplier 4: Avnet Europe; Supplier Part Number 4: TSW-104-07-G-D
J4 = HMTSW-102-07-G-S-240: Header, 100mil, 2x1, Gold, TH; Manufacturer: Samtec; SymbolCreator: a0412235; SymbolVersion: 2013-10-31; PartNumber: HMTSW-102-07-G-S-240; PackageReference: Header, 2.54mm, 2x1, TH; ClassName: Header; CompType: Header; RoHS: Y; MountType: TH; ComponentLink1Description: Datasheet URL; ComponentLink1URL: http://www.samtec.com/documents/webfiles/cpdf/HMTSW-XXX-XX-X-X-XXXX-XX-XX-MKT1.pdf; Publisher: Texas Instruments; LatestRevisionDate: 2016-12-09; Supplier 1: Digi-Key; Supplier Part Number 1: HMTSW-102-07-G-S-240-ND; DNP: DNP
L1 L3 = MPZ2012S601A: Ferrite Bead, 600 ohm @ 100 MHz, 2 A, 0805; Manufacturer: TDK; Imax_A: 2; DCR_ohm: 0.1; Value1: 0.1 ohm; Value2: 2A; ZTyp@100MHz_Ohm: 600; CompType: Ferrite Bead; SymbolVersion: 2009-06-02; PartNumber: MPZ2012S601A; MountType: SMT; PackageReference: 0805; Published: 2014-04-30; Publisher: Texas Instruments; LatestRevisionDate: 2016-04-05; ComponentLink1Description: Datasheet link; ComponentLink1URL: http://www.tdk.co.jp/tefe02/e9413_mpz.pdf; RoHS: Y; Supplier 1: Digi-Key; Supplier Part Number 1: 445-2206-1-ND; Supplier 2: Mouser; Supplier Part Number 2: 810-MPZ2012S601A; Supplier 3: Farnell; Supplier Part Number 3: 1669753
L2 = LQH44PN1R0NP0L: Murata LQH44P_P0 Series Shielded Wire-wound SMD Inductor 1 H 30% 2950mA Idc; Manufacturer_Name: Murata Electronics; Geometry.Height: 1.8mm; Mouser Part Number: *; Manufacturer_Part_Number: LQH44PN1R0NP0L; Datasheet Link: https://www.mouser.co.il/datasheet/2/281/o05e-1115425.pdf
LED1 = LTST-C190CKT: LED, Red, SMD; Manufacturer: Lite-On; Vf_V: 2; Value2: 2V; Io_A: 0.02; Tjmax_C: 85; Power_TotalModule: 0.0625; Value1: 0.0625W; U/M: EA; Published: 2008-07-11; LatestRevisionDate: 2016-04-10; PackageReference: Red LED, 1.6x0.8x0.8mm; Publisher: Texas Instruments; CompType: LED; PartNumber: LTST-C190CKT; SymbolVersion: 2008-12-08; MountType: SMT; RoHS: Y; Type: ?; Color: red; ComponentLink1URL: http://optoelectronics.liteon.com/en-us/api/DwonloadFileHandler.ashx?txtSpecNo=DS-22-98-0009&txtPartNo=LTST-C190CKT; ComponentLink1Description: Datasheet link; Supplier 1: Digi-Key; Supplier Part Number 1: 160-1181-1-ND; Supplier 2: Mouser; Supplier Part Number 2: 859-LTST-C190CKT; ComponentLink2Description: digi-key; ComponentLink2URL: https://www.digikey.com/product-detail/en/lite-on-inc/LTST-C190CKT/160-1181-2-ND/269228
NT1-NT7 = Net-Tie: Single point connection between nets.; SymbolCreator: codlsc; SymbolVersion: 2009-07-01; MountType: SMT; PackageReference: N/A; Publisher: Texas Instruments; LatestRevisionDate: 2015-10-18; LatestRevisionNote: Added Alternate PartNumber and Alternate Manufacturer parameters to appropriate components.
P1 = Header 4: Header, 4-Pin; LatestRevisionDate: 17-Jul-2002; LatestRevisionNote: Re-released for DXP Platform.; Publisher: Altium Limited
P2 = Header 5: Header, 5-Pin; LatestRevisionDate: 17-Jul-2002; LatestRevisionNote: Re-released for DXP Platform.; Publisher: Altium Limited
P3 = Header 3: Header, 3-Pin; LatestRevisionDate: 17-Jul-2002; LatestRevisionNote: Re-released for DXP Platform.; Publisher: Altium Limited
P4 P5 = Header 8: Header, 8-Pin; LatestRevisionDate: 17-Jul-2002; LatestRevisionNote: Re-released for DXP Platform.; Publisher: Altium Limited
R1 R4 = CRCW0402200RFKED: RES, 200, 1%, 0.063 W, 0402; Manufacturer: Vishay-Dale; Value: 200; CompType: Resistor; Value_Code: 200R; Tolerance_%: 1; Power_W: 0.063; Value2: 0.063W; VDC_V: 50; TempCo: 100 ppm/C; EIA_Code: E96; U/M: EA; AEC Category: Q200; Published: 2008-06-26; LatestRevisionDate: 2016-04-09; PackageReference: 0402; Publisher: Texas Instruments; SymbolVersion: 2009-05-29; PartNumber: CRCW0402200RFKED; RoHS: Y; Res_ohm: 200; MountType: SMT; Technology: Thick Film; ComponentLink1Description: Datasheet link; ComponentLink1URL: http://www.vishay.com/docs/20035/dcrcwe3.pdf; Supplier 1: Digi-Key; Supplier Part Number 1: 541-200LCT-ND; Supplier 2: Mouser; Supplier Part Number 2: 71-CRCW0402-200-E3; Supplier 3: Farnell; Supplier Part Number 3: 1469695; AEC Qualified: ?
R2 R12 R13 = CRCW0402470RJNED: RES, 470, 5%, 0.063 W, 0402; Manufacturer: Vishay-Dale; Value: 470; CompType: Resistor; Value_Code: 470R; Tolerance_%: 5; Power_W: 0.063; Value2: 0.063W; VDC_V: 50; TempCo: 200 ppm/C; EIA_Code: E24; U/M: EA; AEC Category: Q200; Published: 2008-06-26; LatestRevisionDate: 2016-04-09; PackageReference: 0402; Publisher: Texas Instruments; SymbolVersion: 2009-05-29; PartNumber: CRCW0402470RJNED; RoHS: Y; Res_ohm: 470; Value1: 5%; MountType: SMT; Technology: Thick Film; ComponentLink1Description: Datasheet link; ComponentLink1URL: http://www.vishay.com/docs/20035/dcrcwe3.pdf; Supplier 1: Digi-Key; Supplier Part Number 1: 541-470JCT-ND; Supplier 2: Mouser; Supplier Part Number 2: 71-CRCW0402J-470-E3; Supplier 3: Farnell; Supplier Part Number 3: 1537425; AEC Qualified: ?
R3 R5 = CRCW040222R0JNED: RES, 22, 5%, 0.063 W, 0402; Manufacturer: Vishay-Dale; Value: 22; CompType: Resistor; Value_Code: 22R0; Tolerance_%: 5; Power_W: 0.063; Value2: 0.063W; VDC_V: 50; TempCo: 200 ppm/C; EIA_Code: E24; U/M: EA; AEC Category: Q200; Published: 2008-06-26; LatestRevisionDate: 2016-04-09; PackageReference: 0402; Publisher: Texas Instruments; SymbolVersion: 2009-05-29; PartNumber: CRCW040222R0JNED; RoHS: Y; Res_ohm: 22; Value1: 5%; MountType: SMT; Technology: Thick Film; ComponentLink1Description: Datasheet link; ComponentLink1URL: http://www.vishay.com/docs/20035/dcrcwe3.pdf; Supplier 1: Digi-Key; Supplier Part Number 1: 541-22JCT-ND; Supplier 2: Mouser; Supplier Part Number 2: 71-CRCW0402J-22-E3; Supplier 3: Farnell; Supplier Part Number 3: 1514685; AEC Qualified: ?
R6 R7 = Resistor: RES, 0, 5%, 0.063 W, 0402; Manufacturer: Used in BOM report; U/M: EA; LatestRevisionDate: 2015-10-18; PackageReference: Used in PnP output and some BOM reports; Publisher: Texas Instruments; CompType: Resistor; SymbolVersion: 2009-05-29; RoHS: Used in BOM report.  Use Y or N.; MountType: SMT or TH (used in PnP report); ComponentLink1Description: Datasheet Link; ComponentLink1URL: Paste URL for datasheet here; Alternate Manufacturer: -; Alternate PartNumber: -; LatestRevisionNote: Added Alternate PartNumber and Alternate Manufacturer parameters to appropriate components.
  R6: PartNumber: CRCW04021M74FKED
  R7: Value: DNP; PartNumber: DNP
R8 = Resistor: RES 1M OHM 1% 1/16W 0402; Manufacturer: Used in BOM report; U/M: EA; LatestRevisionDate: 2015-10-18; PackageReference: Used in PnP output and some BOM reports; Publisher: Texas Instruments; CompType: Resistor; SymbolVersion: 2009-05-29; PartNumber: CRCW04021M00JNED; RoHS: Used in BOM report.  Use Y or N.; MountType: SMT or TH (used in PnP report); ComponentLink1Description: Datasheet Link; ComponentLink1URL: Paste URL for datasheet here; Alternate Manufacturer: -; Alternate PartNumber: -; LatestRevisionNote: Added Alternate PartNumber and Alternate Manufacturer parameters to appropriate components.
R9 R11 R14 = CRCW0402100KJNED: RES, 100 k, 5%, 0.063 W, 0402; Manufacturer: Vishay-Dale; Value: 100k; CompType: Resistor; Res_ohm: 100000; Tolerance_%: 5; Power_W: 0.063; Value2: 0.063W; VDC_V: 50; TempCo: 200 ppm/C; EIA_Code: E24; U/M: EA; Published: 2008-06-26; LatestRevisionDate: 2014-07-21; PackageReference: 0402; Publisher: Texas Instruments; SymbolVersion: 2009-05-29; PartNumber: CRCW0402100KJNED; RoHS: Y; Value_Code: 100k; Value1: 5%; MountType: SMT; Technology: Thick Film; ComponentLink1Description: Datasheet link; ComponentLink1URL: http://www.vishay.com/docs/20035/dcrcwe3.pdf; Supplier 1: Mouser; Supplier Part Number 1: 71-CRCW0402J-100K-E3; Supplier 2: Farnell; Supplier Part Number 2: 1652738; Supplier 3: Newark; Supplier Part Number 3: 59M6699
R10 = CRCW040247K0JNED: RES, 47 k, 5%, 0.063 W, 0402; Manufacturer: Vishay-Dale; Value: 47k; CompType: Resistor; Res_ohm: 47000; Value_Code: 47k0; Tolerance_%: 5; Power_W: 0.063; Value2: 0.063W; VDC_V: 50; TempCo: 200 ppm/C; EIA_Code: E24; U/M: EA; Published: 2008-06-26; LatestRevisionDate: 2014-07-21; PackageReference: 0402; Publisher: Texas Instruments; SymbolVersion: 2009-05-29; PartNumber: CRCW040247K0JNED; RoHS: Y; Value1: 5%; MountType: SMT; Technology: Thick Film; ComponentLink1Description: Datasheet link; ComponentLink1URL: http://www.vishay.com/docs/20035/dcrcwe3.pdf; Supplier 1: Digi-Key; Supplier Part Number 1: 541-47KJCT-ND; Supplier 2: Farnell; Supplier Part Number 2: 1514553; Supplier 3: Newark; Supplier Part Number 3: 52K7099
S1 = NKK AB11AH-HA: pin to pad: 3>2; Supplier 1: Avnet Europe; Supplier Part Number 1: PTS645SM43SMTR 92 LFS
U1 = MSP430FR6047IPZR: Mixed-Signal Microcontroller, PZ0100A (LQFP-100); Manufacturer: Texas Instruments; SymbolCreator: Altium; SizeArea_mm2: 256; SizeAreaWB_mm2: 324; SizeX_mm: 16; SizeZ_mm: 1.6; CompType: IC; U/M: EA; Number of UART Channels: 4; SymbolVersion: 2016-11-29; PartNumber: MSP430FR6047IPZR; Alternate PartNumber: MSP430FR6047IPZ; PackageReference: PZ0100A; PackageDescription: LQFP-100; MountType: SMT; SizeY_mm: 16; ComponentLink1Description: Datasheet Link; ComponentLink1URL: https://sps06.itg.ti.com/sites/KMS/crossdivteams/altium/docs/ComponentDatasheets/SLASEB7_MSP430FR6047_Int.pdf; Publisher: Texas Instruments; LatestRevisionDate: 2016-11-30; Alternate Manufacturer: Texas Instruments; Manufacturer Part Number: MSP430FR6047IPZR; Min Operating Temperature: -40°C; Max Operating Temperature: 85°C; Supplier 1: Digi-Key; Supplier Part Number 1: 296-47912-2-ND; Supplier 2: Digi-Key; Supplier Part Number 2: 296-47912-1-ND; Supplier 3: Avnet Europe; Supplier Part Number 3: MSP430FR6047IPZR
U2 = TPS78001DDCR: Single Output LDO, 150 mA, Adjustable 1.22 to 5.25 V Output, 2.2 to 5.5 V Input, with 500 nA Quiescent Current, 5-pin SOT (DDC), -40 to 125 degC, Green (RoHS & no Sb/Br); Manufacturer: Texas Instruments; Alternate PartNumber: Equivalent; Accuracy(%): 3; Dynamic Voltage Scaling: TRUE; Iout(Max)(A): 0.15; Iq(Typ)(mA): 0.0005; SubFamily: Single Channel LDO; Vdo(Typ)(mV): 200; Vin(Max)(V): 5.5; Vin(Min)(V): 2.2; Vout Adj(Max)(V): 5.25; Vout Adj(Min)(V): 1.22; DatasheetVersion: SBVS083D; PackageVersion: 4204403-2/E; PackageReference: DDC0005A; PackageDescription: 5-Pin Plastic Small Outline, Body 2.9 x 1.6 mm, 0.95 mm Pitch; Supplier 1: Digi-Key; Supplier Part Number 1: 296-23331-2-ND; Supplier 2: Digi-Key; Supplier Part Number 2: 296-23331-1-ND; Supplier 3: Digi-Key; Supplier Part Number 3: 296-23331-6-ND; Supplier 4: Newark; Supplier Part Number 4: 95M0131; Supplier 5: Mouser; Supplier Part Number 5: 595-TPS78001DDCR; Eco-Plan: Green (RoHS & no Sb/Br); MountType: SMT; Code_JEDEC: MO-193; PartNumber: TPS78001DDCR; ComponentLink1Description: Manufacturer URL; ComponentLink1URL: http://www.ti.com/; ComponentLink2Description: Datasheet; ComponentLink2URL: http://www.ti.com/general/docs/lit/getliterature.tsp?genericPartNumber=TPS78001&fileType=pdf; ComponentLink3Description: Package Specification; ComponentLink3URL: http://www.ti.com/litv/pdf/mpds123d; Alternate Manufacturer: Texas Instruments; Supplier 6: Avnet; Supplier Part Number 6: TPS78001DDCR
U3 = NCP6354BMTAATBG: ON Semiconductor, NCP6354BMTAATBG Step-Down Switching Regulator 3.3A Adjustable, 0.6  5.5 V, 8-Pin WDFN; Geometry.Height: 0.8mm; Mouser Part Number: *; Manufacturer_Name: ON Semiconductor; Manufacturer_Part_Number: NCP6354BMTAATBG; Datasheet Link: *
Y1 = ABS07-32.768KHZ-9-T: CRYSTAL, 32.768KHZ, 9PF, SMD; Manufacturer: Abracon Corporation; SymbolCreator: a0412235; U/M: EA; TaMin_C: -40; TaMax_C: 85; Frequency Stability: ±20ppm; SymbolVersion: 2008-07-09; PartNumber: ABS07-32.768KHZ-9-T; CompType: Crystal; PackageReference: 3.2x0.9x1.5mm; MountType: SMT; RoHS: Y; ComponentLink1Description: Datasheet Link; ComponentLink1URL: http://www.abracon.com/Resonators/ABS07.pdf; Publisher: Texas Instruments; LatestRevisionDate: 2016-11-29; Supplier 1: Digi-Key; Supplier Part Number 1: 535-9544-1-ND; Supplier 2: Mouser; Supplier Part Number 2: 815-ABS07-32.768K9T; Supplier 3: Farnell; Supplier Part Number 3: 2101346
Y2 = AWSCR-8.00CV-T: Ceramic Resonator, 8MHz, 22pF, SMD; Manufacturer: Abracon Corporation; SymbolCreator: a0799721; SizeAreaWB_mm2: 19.27; SizeArea_mm2: 11.47; SizeX_mm: 3.7; SizeY_mm: 3.1; SizeZ_mm: 1.2; U/M: EA; TaMin_C: -25; TaMax_C: 85; SymbolVersion: 2016-2-15; PartNumber: AWSCR-8.00CV-T; CompType: Resonator; PackageReference: 3.7x3.1mm; MountType: SMT; RoHS: Y; ComponentLink1Description: Datasheet Link; ComponentLink1URL: http://www.abracon.com/Resonators/AWSCR_CV.pdf; Publisher: Texas Instruments; LatestRevisionDate: 2017-02-02; Supplier 1: Digi-Key; Supplier Part Number 1: 535-10004-1-ND; Supplier 2: Mouser; Supplier Part Number 2: 815-AWSCR-8.00CV-T
Y3 = ABM3-8.000MHZ-D2Y-T: Crystal, 8MHz, SMD; Manufacturer: Abracon Corporation; SymbolCreator: a0412235; U/M: EA; TaMin_C: -40; TaMax_C: 85; Frequency Stability: ±30ppm; SymbolVersion: 2008-07-09; PartNumber: ABM3-8.000MHZ-D2Y-T; CompType: Crystal; PackageReference: SMD, 2-Leads, Body 3.2x1.3x5 mm; MountType: SMT; RoHS: E; ComponentLink1Description: Datasheet Link; ComponentLink1URL: http://www.abracon.com/Resonators/abm3.pdf; Publisher: Texas Instruments; LatestRevisionDate: 2017-02-02; Supplier 1: Digi-Key; Supplier Part Number 1: 535-10630-1-ND; Supplier 2: Mouser; Supplier Part Number 2: 815-ABM3-8-D2Y-T; Supplier 3: Farnell; Supplier Part Number 3: 2101329